# EAGLE design Supercap (EAGLE 7.1.0)
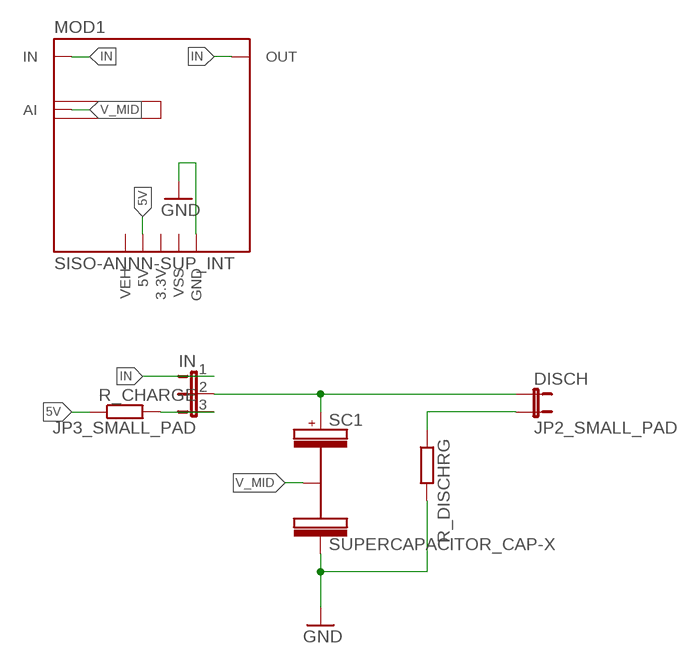
[diagram p0: schematic, sheet 1]

## Parts
DISCH  JP2_SMALL_PAD  [JP2_SMALL_PAD]
IN  JP3_SMALL_PAD  [JP3_SMALL_PAD]
MOD1  SISO-ANNN-SUP_INT  [SISO-ANNN-SUP]
R_CHARGE  R_THROUGH-HOLE  [R_THROUGH-HOLE]
R_DISCHRG  R_THROUGH-HOLE  [R_THROUGH-HOLE]
SC1  SUPERCAPACITOR_CAP-X  [SUPERCAPACITOR_CAP-X]

## Nets
5V: MOD1.5V R_CHARGE.1
GND: MOD1.GND1(GND) MOD1.GND2(GND) MOD1.GND3(GND) MOD1.GND4(GND) R_DISCHRG.2 SC1.-1
IN: IN.1 MOD1.IN1(IN) MOD1.IN2(IN) MOD1.IN3(IN) MOD1.IN4(IN) MOD1.OUT1(OUT) MOD1.OUT2(OUT) MOD1.OUT3(OUT) MOD1.OUT4(OUT)
N$1: IN.3 R_CHARGE.2
N$4: DISCH.1 IN.2 SC1.+
N$6: DISCH.2 R_DISCHRG.1
V_MID: MOD1.AI SC1.V_MID

## Power pins joined to a net without a drawn wire
3.3V: MOD1.3.3V
VEH: MOD1.VEH
VSS: MOD1.VSS

## Library data of the parts
DISCH = Jumper_mod:JP2_SMALL_PAD
IN = Jumper_mod:JP3_SMALL_PAD
MOD1 = AllModules:SISO-ANNN-SUP_INT
R_CHARGE R_DISCHRG = Resistor:R_THROUGH-HOLE
SC1 = SUPERCAPACITOR:SUPERCAPACITOR_CAP-X

## Board
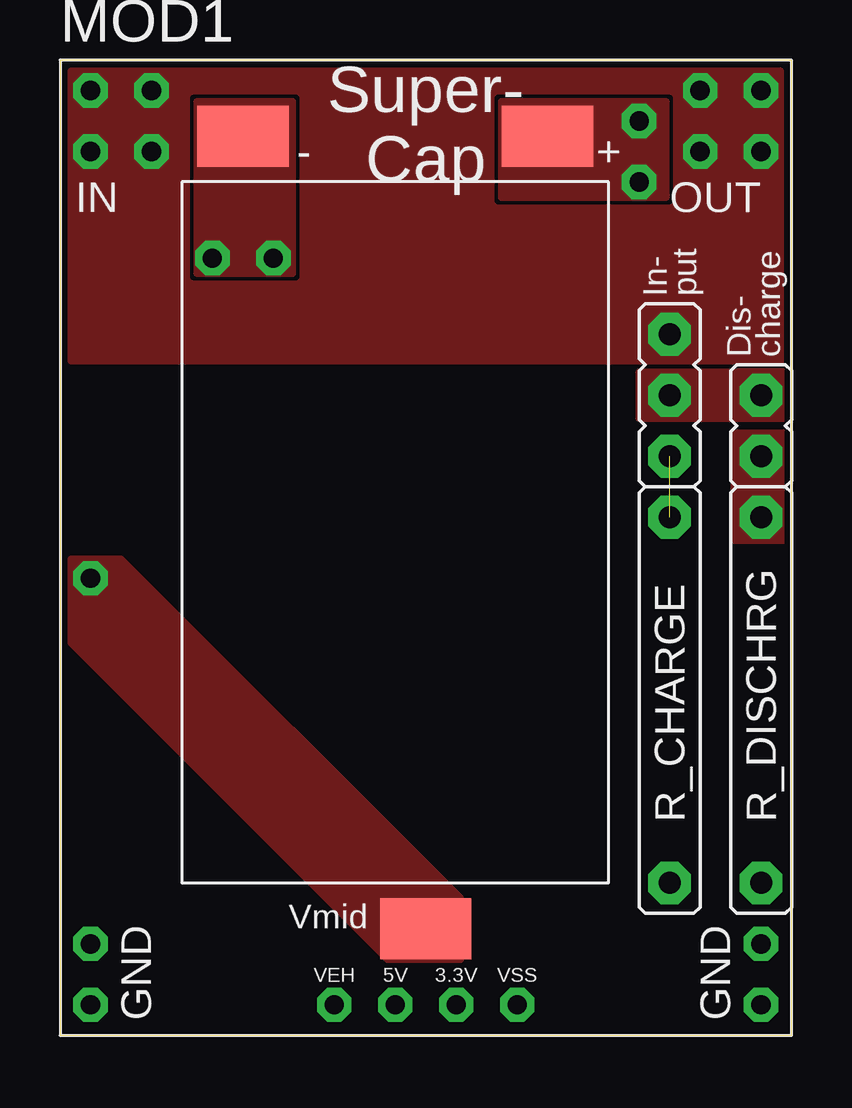
[diagram p1: board, top side]
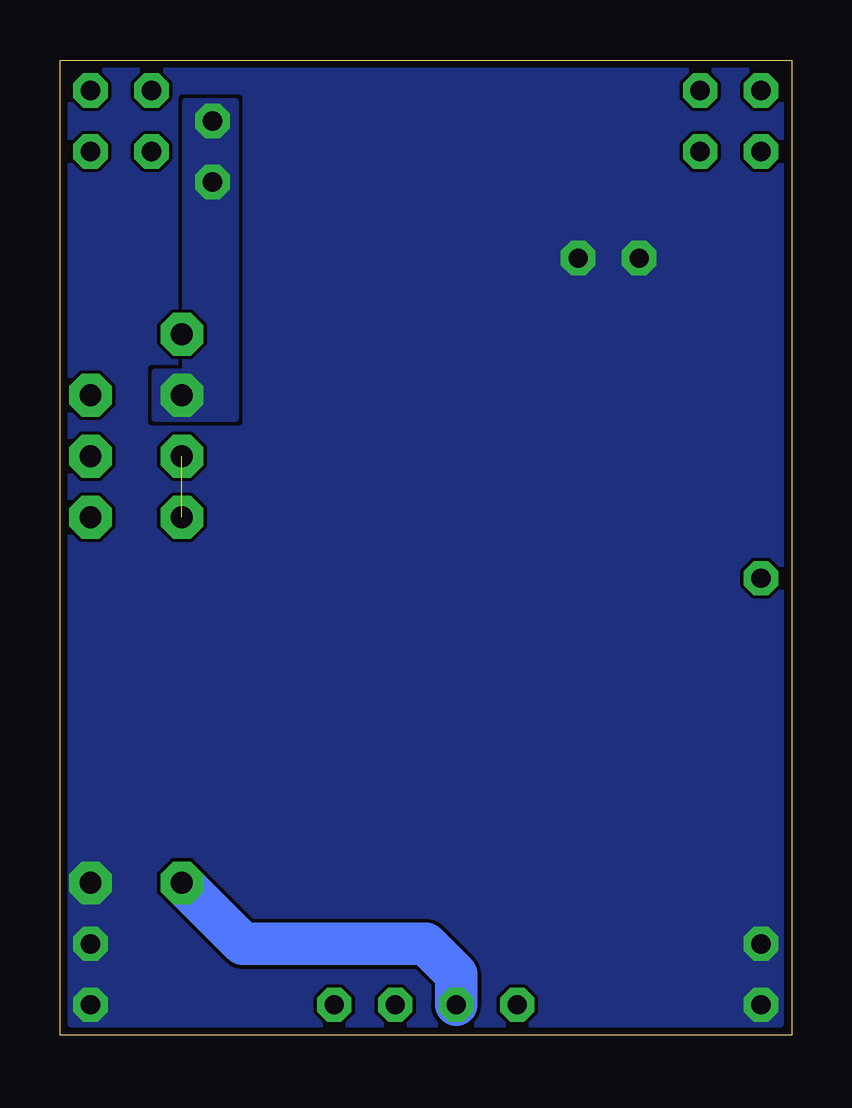
[diagram p2: board, bottom side, seen from below]

Size 30.48 x 40.64 mm. Coordinates in mm from the lower left corner, seen from the top.
Outline: 0,0 30.48,0 30.48,40.64 0,40.64 0,0
Copper layers (1*16): Top 0.035mm / dielectric 1.5mm / Bottom 0.035mm
Design rules "PCB-POOL Standard": minimum track width 0.15mm, minimum drill 0.3mm, track to track 0.15mm, track to pad 0.15mm, pad to pad 0.15mm, via to via 0.15mm, smd to smd 0.15mm, copper to edge 0.3mm, drill to drill 0.2mm, minimum pad ring 0.2mm, minimum via ring 0.15mm, stop-mask expansion 0.075mm, vias tented up to drill 0mil, thermal gap 0.2mm

### Footprints (pad centres in the part's own frame; a part is rotated, then mirrored left to right if it is on the bottom)
JP2_SMALL_PAD = drill 0.914 pad 1.778 octagon: 1 -2.54,0; 2 0,0
JP3_SMALL_PAD = drill 0.914 pad 1.778 octagon: 1 -2.54,0; 2 0,0; 3 2.54,0
SISO-ANNN-SUP = drill 0.8 pad 1.422 octagon: 3.3V 15.24,-38.1; 5V 12.7,-38.1; AI 0,-20.32; GND1 0,-38.1; GND2 0,-35.56; GND3 27.94,-35.56; GND4 27.94,-38.1; IN1 0,0; IN2 0,-2.54; IN3 2.54,0; IN4 2.54,-2.54; OUT1 25.4,0; OUT2 25.4,-2.54; OUT3 27.94,0; OUT4 27.94,-2.54; VEH 10.16,-38.1; VSS 17.78,-38.1
R_THROUGH-HOLE = drill 0.914 pad 1.778 octagon: 1 -8.89,0; 2 6.35,0
SUPERCAPACITOR_CAP-X = smd 3.81 x 2.54: + 6.35,16.51; -1 -6.35,16.51; V_MID 1.27,-16.51

### Placement (x,y rotation side)
DISCH  29.21,24.13 270 top
IN  25.4,26.67 270 top
MOD1  1.27,39.37 0 top
R_CHARGE  25.4,15.24 90 top
R_DISCHRG  29.21,12.7 270 top
SC1  13.97,20.96 0 top

### Tracks (layer width: path | path; a pad name or v marks a point on that pad's centre or on a via)
5V
  Bottom 1.778: MOD1.5V 13.97,2.54 15.24,3.81 22.86,3.81 R_CHARGE.1
GND  (via drill 0.8)
  other vias: 6.35,32.38 8.89,32.38
  pour Top (no thermals): 5.71,38.89 5.71,31.75 9.68,31.75 9.68,38.89
  pour Bottom (rank 2, no thermals): 0.48,40.16 0.48,0.48 30,0.48 30,40.16
IN
  pour Top (rank 2, no thermals): 0.48,40.16 0.48,28.1 30,28.1 30,40.16
N$1  (1 unrouted)
N$4  (via drill 0.8)
  other vias: 24.13,38.1 24.13,35.56
  pour Top (no thermals): 18.41,38.89 18.41,34.92 25.24,34.92 25.24,38.89
  pour Top (no thermals): 24.13,27.62 30.32,27.62 30.32,25.72 24.13,25.72
  pour Bottom (no thermals): 26.51,25.72 23.18,25.72 23.18,38.89 25.24,38.89 25.24,27.62 26.51,27.62
N$6
  pour Top (no thermals): 28.1,25.08 30.16,25.08 30.16,20.64 28.1,20.64
V_MID
  pour Top (no thermals): 0.48,19.84 0.48,16.35 13.65,3.17 16.67,3.17 16.67,5.72 2.54,19.84

### Text on the board
tNames: Super- / Cap | In- / put | Dis- / charge
bStop: Beckedahl & Kokert / 18.09.2015